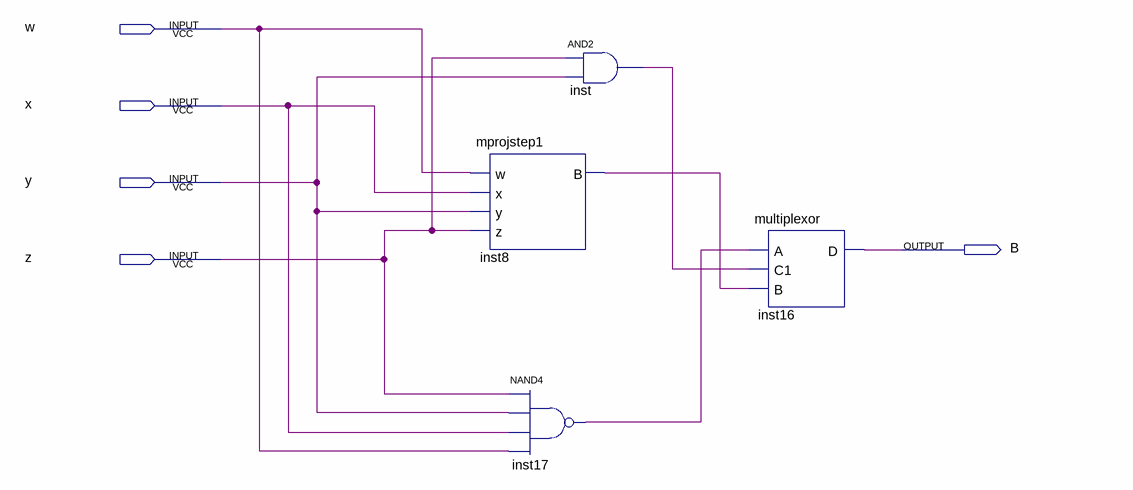
[diagram p0: schematic sheet]
// Quartus schematic mprojstep3.bdf as structural Verilog: 4 symbols, 5 pins
module mprojstep3 (
  input  w,
  input  x,
  input  y,
  input  z,
  output B
);

  wire inst8_b, inst17_out, inst_out;

  mprojstep1 inst8 (.w(w), .x(x), .y(y), .z(z), .B(inst8_b));
  nand inst17 (inst17_out, z, y, x, w);
  and inst (inst_out, z, y);
  multiplexor inst16 (.A(inst17_out), .C1(inst_out), .B(inst8_b), .D(B));
endmodule
